# Altium schematic sheet 驱动_2.SchDoc
size A4; SheetNumber: 2; SheetTotal: 2
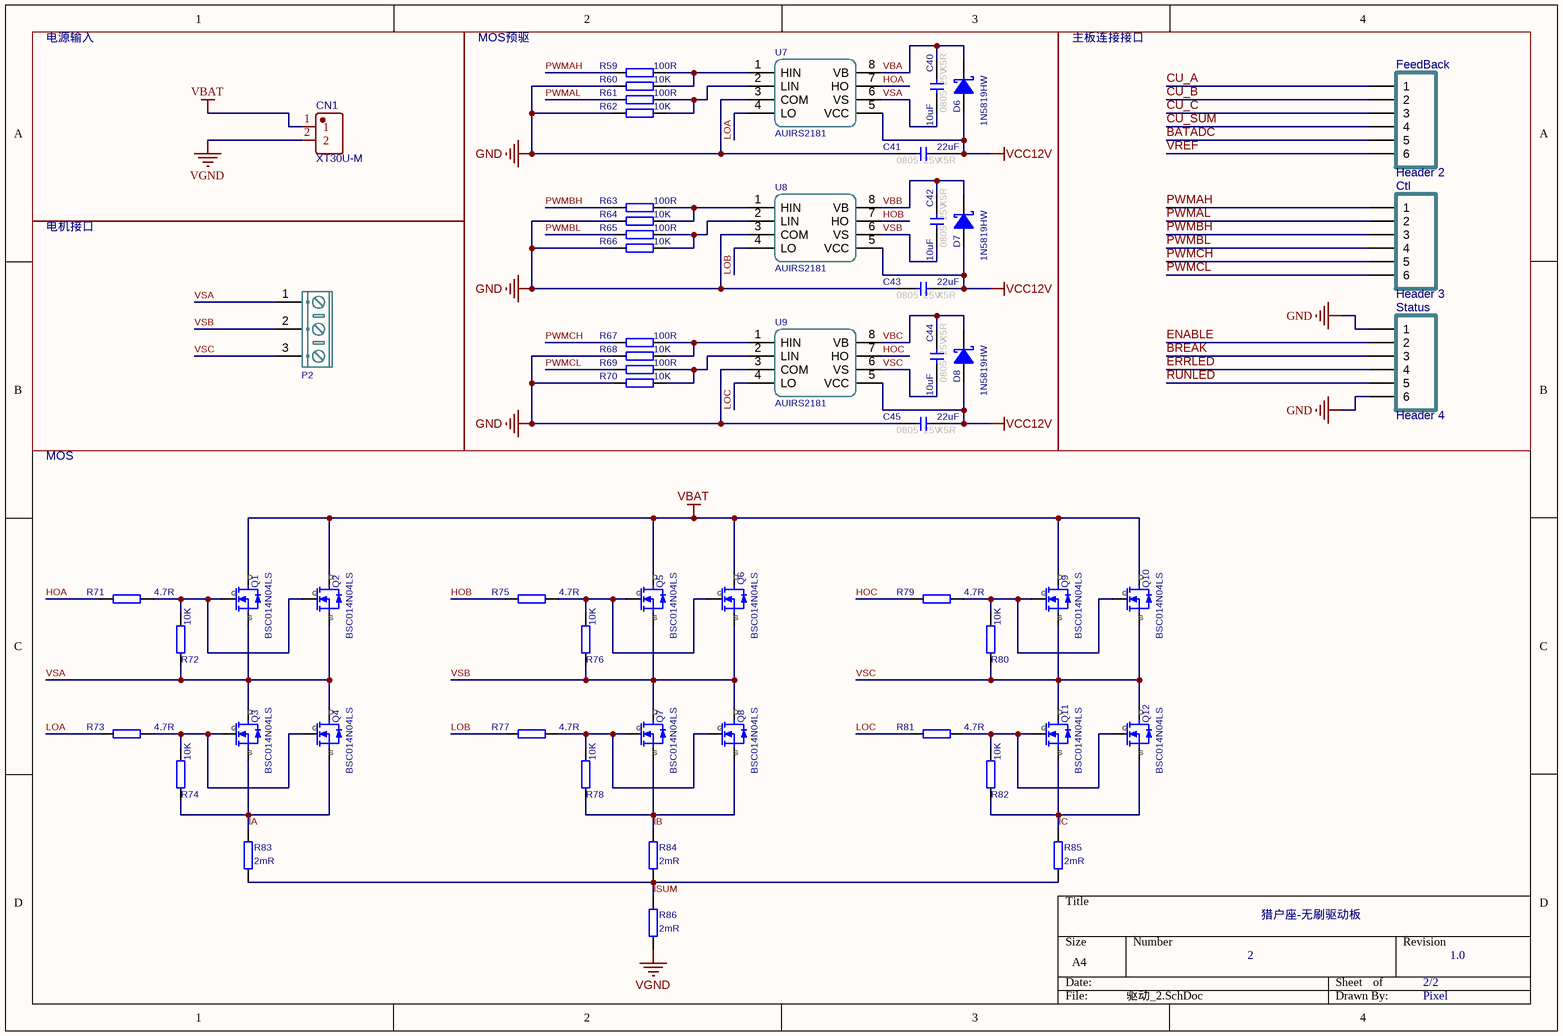
[diagram p0: 驱动_2.SchDoc]

## Parts
C40  value 10uF  FootPrint: 0805  Voltage: 25V  Type: X5R  [CAPC2012[0805]S-N]  (hidden comment: 10uF 25V X5R)
C41  value 22uF  FootPrint: 0805  Voltage: 25V  Type: X5R  [CAPC2012[0805]S-N]  (hidden comment: 22uF 25V X5R)
C42  value 10uF  FootPrint: 0805  Voltage: 25V  Type: X5R  [CAPC2012[0805]S-N]  (hidden comment: 10uF 25V X5R)
C43  value 22uF  FootPrint: 0805  Voltage: 25V  Type: X5R  [CAPC2012[0805]S-N]  (hidden comment: 22uF 25V X5R)
C44  value 10uF  FootPrint: 0805  Voltage: 25V  Type: X5R  [CAPC2012[0805]S-N]  (hidden comment: 10uF 25V X5R)
C45  value 22uF  FootPrint: 0805  Voltage: 25V  Type: X5R  [CAPC2012[0805]S-N]  (hidden comment: 22uF 25V X5R)
CN1  XT30U-M  [CONN-TH_XT30U-M]
Ctl  Header 3  [ZH1.5-6P-SH]
D6  1N5819HW  [SOD-123-L]
D7  1N5819HW  [SOD-123-L]
D8  1N5819HW  [SOD-123-L]
FeedBack  Header 2  [ZH1.5-6P-SH]
P2  KF/WJ/DG 30x connecter  [KF/WJ/DG 301-3p-5.0mm]  (value not drawn)
Q1  BSC014N04LS  [TDSON-8]
Q2  BSC014N04LS  [TDSON-8]
Q3  BSC014N04LS  [TDSON-8]
Q4  BSC014N04LS  [TDSON-8]
Q5  BSC014N04LS  [TDSON-8]
Q6  BSC014N04LS  [TDSON-8]
Q7  BSC014N04LS  [TDSON-8]
Q8  BSC014N04LS  [TDSON-8]
Q9  BSC014N04LS  [TDSON-8]
Q10  BSC014N04LS  [TDSON-8]
Q11  BSC014N04LS  [TDSON-8]
Q12  BSC014N04LS  [TDSON-8]
R59  value 100R  [RESC1005[0402]S-N]  (hidden comment: 100R ±1%)
R60  value 10K  [RESC1005[0402]S-N]  (hidden comment: 10K ±1%)
R61  value 100R  [RESC1005[0402]S-N]  (hidden comment: 100R ±1%)
R62  value 10K  [RESC1005[0402]S-N]  (hidden comment: 10K ±1%)
R63  value 100R  [RESC1005[0402]S-N]  (hidden comment: 100R ±1%)
R64  value 10K  [RESC1005[0402]S-N]  (hidden comment: 10K ±1%)
R65  value 100R  [RESC1005[0402]S-N]  (hidden comment: 100R ±1%)
R66  value 10K  [RESC1005[0402]S-N]  (hidden comment: 10K ±1%)
R67  value 100R  [RESC1005[0402]S-N]  (hidden comment: 100R ±1%)
R68  value 10K  [RESC1005[0402]S-N]  (hidden comment: 10K ±1%)
R69  value 100R  [RESC1005[0402]S-N]  (hidden comment: 100R ±1%)
R70  value 10K  [RESC1005[0402]S-N]  (hidden comment: 10K ±1%)
R71  value 4.7R  [RESC1608[0603]S-N]  (hidden comment: 4.7R ±1%)
R72  value 10K  [RESC1005[0402]S-N]  (hidden comment: 10K ±1%)
R73  value 4.7R  [RESC1608[0603]S-N]  (hidden comment: 4.7R ±1%)
R74  value 10K  [RESC1005[0402]S-N]  (hidden comment: 10K ±1%)
R75  value 4.7R  [RESC1608[0603]S-N]  (hidden comment: 4.7R ±1%)
R76  value 10K  [RESC1005[0402]S-N]  (hidden comment: 10K ±1%)
R77  value 4.7R  [RESC1608[0603]S-N]  (hidden comment: 4.7R ±1%)
R78  value 10K  [RESC1005[0402]S-N]  (hidden comment: 10K ±1%)
R79  value 4.7R  [RESC1608[0603]S-N]  (hidden comment: 4.7R ±1%)
R80  value 10K  [RESC1005[0402]S-N]  (hidden comment: 10K ±1%)
R81  value 4.7R  [RESC1608[0603]S-N]  (hidden comment: 4.7R ±1%)
R82  value 10K  [RESC1005[0402]S-N]  (hidden comment: 10K ±1%)
R83  value 2mR  [RESC6332[2512]S]  (hidden comment: 2mR ±1%)
R84  value 2mR  [RESC6332[2512]S]  (hidden comment: 2mR ±1%)
R85  value 2mR  [RESC6332[2512]S]  (hidden comment: 2mR ±1%)
R86  value 2mR  [RESC6332[2512]S]  (hidden comment: 2mR ±1%)
Status  Header 4  [ZH1.5-6P-SH]
U7  AUIRS2181  [SOP-8]
U8  AUIRS2181  [SOP-8]
U9  AUIRS2181  [SOP-8]

## Blocks framed on the sheet
电源输入: CN1
MOS预驱: C40-C45 D6-D8 R59-R70 U7-U9
主板连接接口: Ctl FeedBack Status
电机接口: P2

## Nets
GND: C41.1 C43.1 C45.1 R60.1 R62.1 R64.1 R66.1 R68.1 R70.1 Status.1 Status.6 U7.3(COM) U8.3(COM) U9.3(COM)
VBAT: CN1.1 Q1.1(D) Q2.1(D) Q5.1(D) Q6.1(D) Q9.1(D) Q10.1(D)
VCC12V: C41.2 C43.2 C45.2 D6.A D7.A D8.A U7.5(VCC) U8.5(VCC) U9.5(VCC)
VGND: CN1.2 R86.1
BATADC: FeedBack.5
BREAK: Status.3
CU_A: FeedBack.1
CU_B: FeedBack.2
CU_C: FeedBack.3
CU_SUM: FeedBack.4
ENABLE: Status.2
ERRLED: Status.4
HOA: R71.1 U7.7(HO)
HOB: R75.1 U8.7(HO)
HOC: R79.1 U9.7(HO)
IA: Q3.3(S) Q4.3(S) R74.1 R83.2
IB: Q7.3(S) Q8.3(S) R78.1 R84.2
IC: Q11.3(S) Q12.3(S) R82.1 R85.2
ISUM: R83.1 R84.1 R85.1 R86.2
LOA: R73.1 U7.4(LO)
LOB: R77.1 U8.4(LO)
LOC: R81.1 U9.4(LO)
PWMAH: Ctl.1 R59.1
PWMAL: Ctl.2 R61.1
PWMBH: Ctl.3 R63.1
PWMBL: Ctl.4 R65.1
PWMCH: Ctl.5 R67.1
PWMCL: Ctl.6 R69.1
RUNLED: Status.5
VBA: C40.2 D6.K U7.8(VB)
VBB: C42.2 D7.K U8.8(VB)
VBC: C44.2 D8.K U9.8(VB)
VREF: FeedBack.6
VSA: C40.1 P2.1 Q1.3(S) Q2.3(S) Q3.1(D) Q4.1(D) R72.1 U7.6(VS)
VSB: C42.1 P2.2 Q5.3(S) Q6.3(S) Q7.1(D) Q8.1(D) R76.1 U8.6(VS)
VSC: C44.1 P2.3 Q9.3(S) Q10.3(S) Q11.1(D) Q12.1(D) R80.1 U9.6(VS)
NetQ1_2: Q1.2(G) Q2.2(G) R71.2 R72.2
NetQ3_2: Q3.2(G) Q4.2(G) R73.2 R74.2
NetQ5_2: Q5.2(G) Q6.2(G) R75.2 R76.2
NetQ7_2: Q7.2(G) Q8.2(G) R77.2 R78.2
NetQ9_2: Q9.2(G) Q10.2(G) R79.2 R80.2
NetQ11_2: Q11.2(G) Q12.2(G) R81.2 R82.2
NetR59_2: R59.2 R60.2 U7.1(HIN)
NetR61_2: R61.2 R62.2 U7.2(LIN)
NetR63_2: R63.2 R64.2 U8.1(HIN)
NetR65_2: R65.2 R66.2 U8.2(LIN)
NetR67_2: R67.2 R68.2 U9.1(HIN)
NetR69_2: R69.2 R70.2 U9.2(LIN)

## Notes on the sheet
- MOS
- 猎户座-无刷驱动板
- 2
- 2/2
- 1.0
- Pixel

## Library data of the parts
C40 C42 C44 = 10uF 0805 25V X5R: 贴片瓷片电容; MLCC; 0805(2012);; Revision: V1.0
C41 C43 C45 = 22uF 0805 25V X5R: 贴片瓷片电容; MLCC; 0805(2012);; Revision: V1.0
CN1 = XT30U-M: BOM_Manufacturer: AMASS(艾迈斯); Contributor: lcsc; System: Connector; BOM_Supplier: LCSC; BOM_Supplier Part: C99101; BOM_Manufacturer Part: XT30U-M; link: https://atta.szlcsc.com/upload/public/pdf/source/20170606/1496716542582.pdf; BOM_JLCPCB Part Class: Extended Part; spicePre: C; spiceSymbolName: XT30U-M
Ctl FeedBack Status = Header 6: Header, 6-Pin; System: Connector; LatestRevisionDate: 17-Jul-2002; LatestRevisionNote: Re-released for DXP Platform.; Publisher: Altium Limited; Price(RMB): 0.00
D6-D8 = 1N5819HW: 1N5819HW 肖特基二极管; Revision: V1.0; Value: 1N5819HW
P2 = KF/WJ/DG 30x-3P: 接线端子 3Pin
Q1-Q12 = BSC014N04LS: 英飞凌 N沟 MOS
R59 R61 R63 R65 R67 R69 = Res-Chip_5: 贴片电阻; Power: 1/8W; Revision: V1.0; Tolerance: ±1%
R60 R62 R64 R66 R68 R70 R72 R74 R76 R78 R80 R82 = Res-Chip_1: 贴片电阻; Power: 1/8W; Revision: V1.0; Tolerance: ±1%
R71 R73 R75 R77 R79 R81 = Res-Chip_16: 贴片电阻; Power: 1/8W; Revision: V1.0; Tolerance: ±1%
R83-R86 = Res-Chip_17: 贴片电阻; Power: 1/8W; Revision: V1.0; Tolerance: ±1%